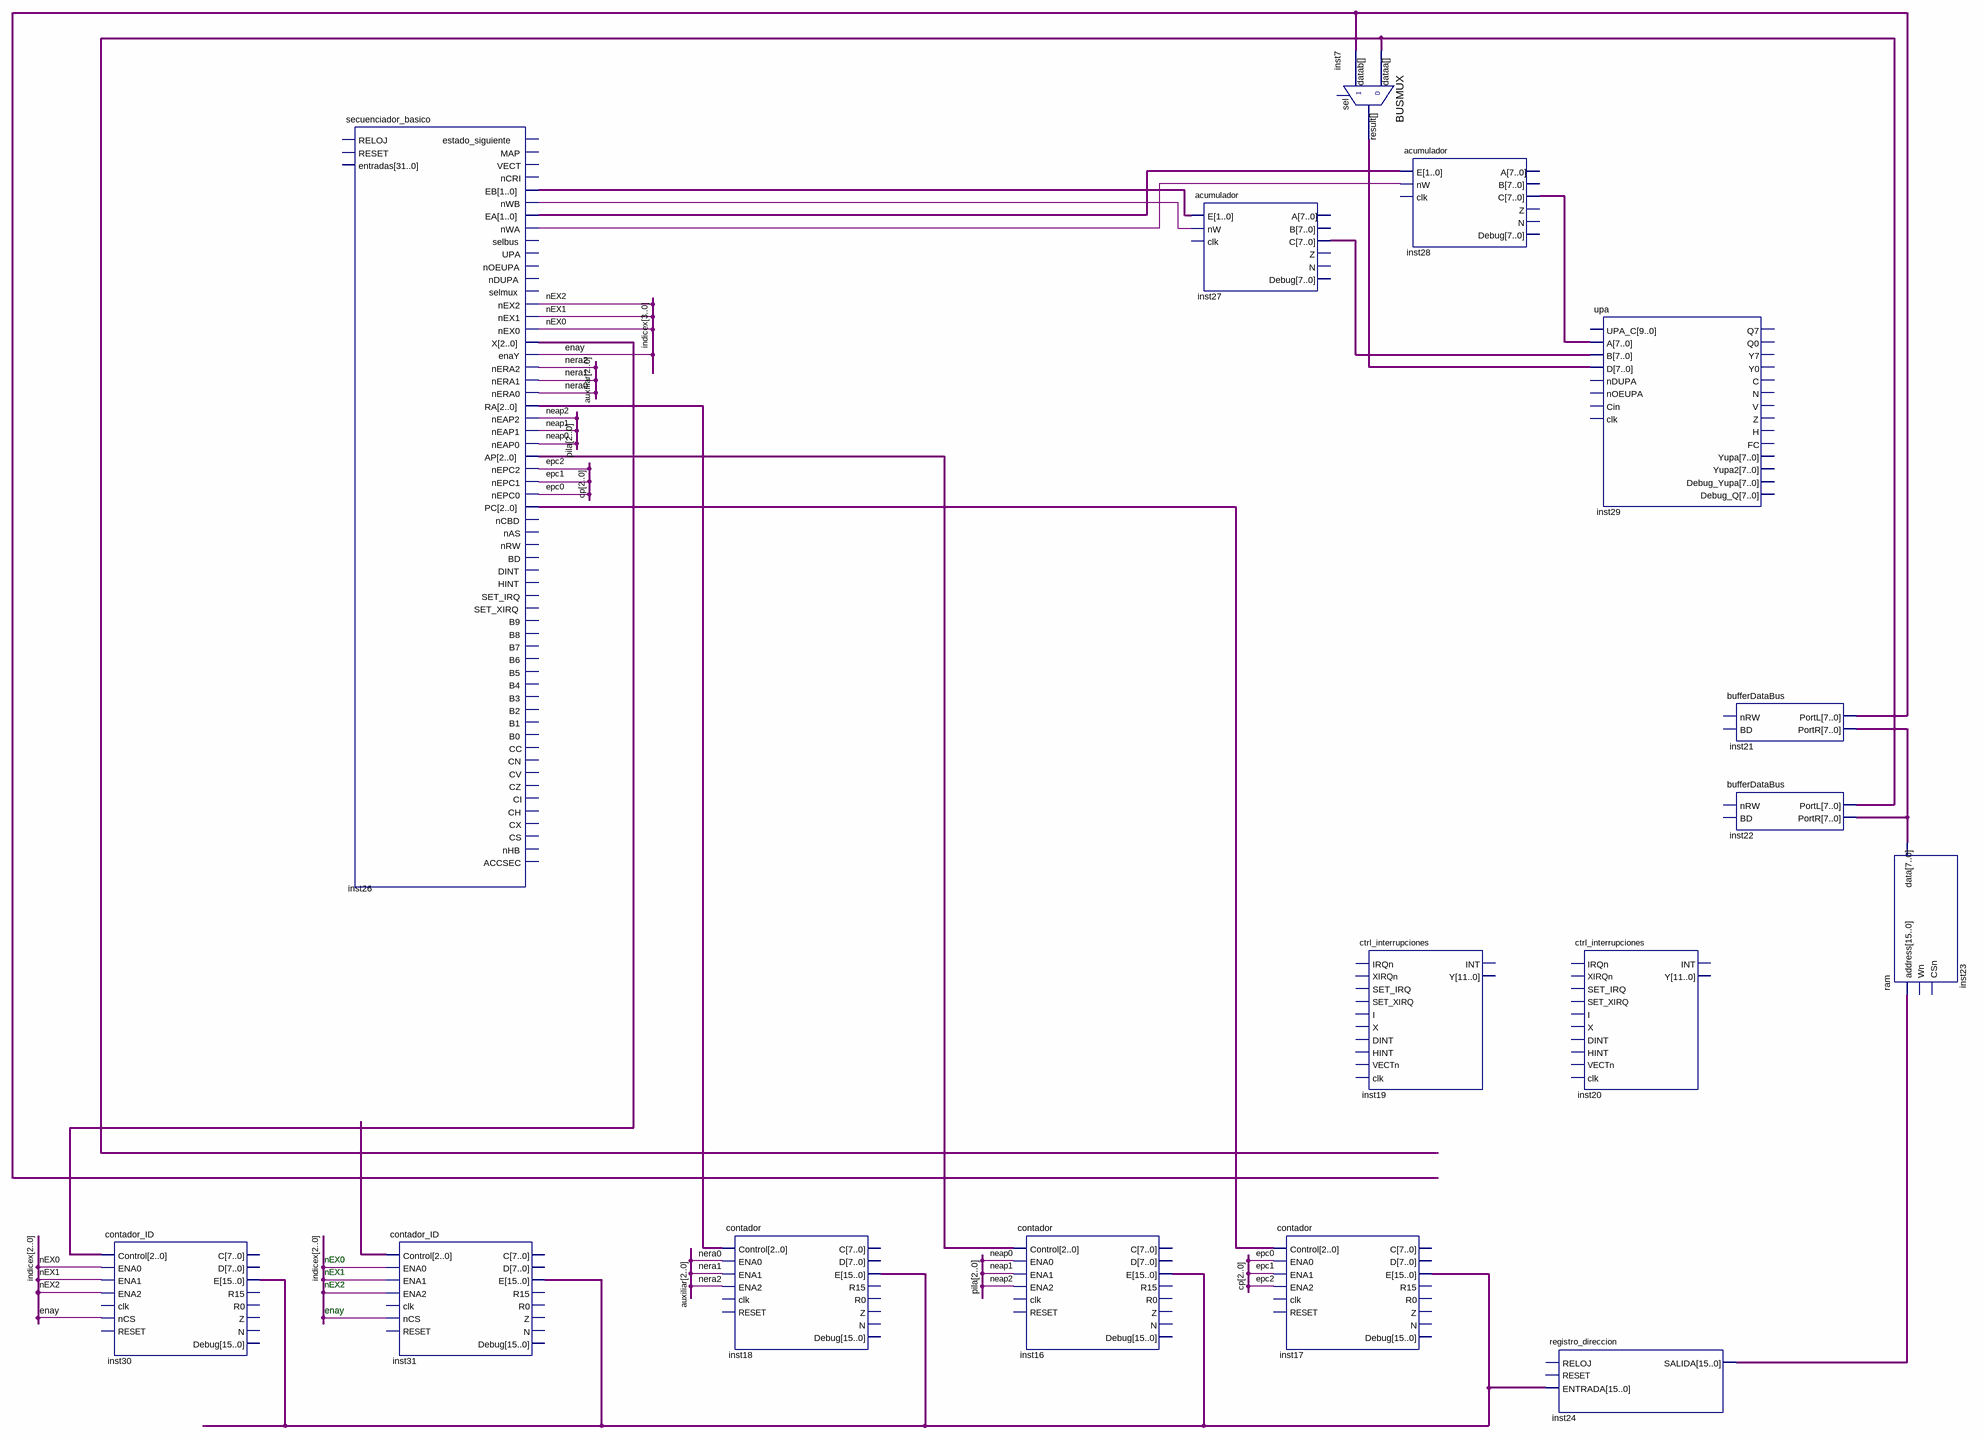
[diagram p0: schematic sheet]
// Quartus schematic OyA_P07.bdf as structural Verilog: 16 symbols, 0 pins
module OyA_P07 (
);

  wire enay, epc0, epc1, epc2, inst26_nwa, inst26_nwb, neap0, neap1, neap2, nera0, nera1, nera2, nEX0, nEX1,
       nEX2;
  wire [1:0] inst26_ea, inst26_eb;
  wire [2:0] inst26_ap, inst26_pc, inst26_ra, inst26_x, undriven;
  wire [7:0] inst7_result, inst21_portl, inst21_portr, inst22_portl, inst27_c, inst28_c;
  wire [15:0] inst24_salida, inst30_e;

  contador_ID inst30 (
    .Control(inst26_x), .ENA0(nEX0), .ENA1(nEX1), .ENA2(nEX2), .nCS(enay), .E(inst30_e));  // open: clk, RESET, Z, N, Debug, C, D, R15, R0
  secuenciador_basico inst26 (
    .EB(inst26_eb), .nWB(inst26_nwb), .EA(inst26_ea), .nWA(inst26_nwa), .nEX2(nEX2), .nEX1(nEX1),
    .nEX0(nEX0), .X(inst26_x), .enaY(enay), .nERA2(nera2), .nERA1(nera1), .nERA0(nera0), .RA(inst26_ra),
    .nEAP2(neap2), .nEAP1(neap1), .nEAP0(neap0), .AP(inst26_ap), .nEPC2(epc2), .nEPC1(epc1), .nEPC0(epc0),
    .PC(inst26_pc));  // open: RELOJ, RESET, entradas, estado_siguiente, MAP, VECT, nCRI, selbus, UPA, nOEUPA, nDUPA, selmux, nCBD, nAS, nRW, BD, DINT, HINT, SET_IRQ, SET_XIRQ, B9, B8, B7, B6, B5, B4, B3, B2, B1, B0, CC, CN, CV, CZ, CI, CH, CX, CS, nHB, ACCSEC
  contador_ID inst31 (
    .Control(undriven), .ENA0(nEX0), .ENA1(nEX1), .ENA2(nEX2), .nCS(enay), .E(inst30_e));  // open: clk, RESET, Z, N, Debug, C, D, R15, R0
  contador inst18 (
    .Control(inst26_ra), .ENA0(nera0), .ENA1(nera1), .ENA2(nera2), .E(inst30_e));  // open: clk, RESET, Z, N, Debug, C, D, R15, R0
  contador inst16 (
    .Control(inst26_ap), .ENA0(neap0), .ENA1(neap1), .ENA2(neap2), .E(inst30_e));  // open: clk, RESET, Z, N, Debug, C, D, R15, R0
  acumulador inst27 (.E(inst26_eb), .nW(inst26_nwb), .C(inst27_c));  // open: clk, Z, N, Debug, A, B
  contador inst17 (
    .Control(inst26_pc), .ENA0(epc0), .ENA1(epc1), .ENA2(epc2), .E(inst30_e));  // open: clk, RESET, Z, N, Debug, C, D, R15, R0
  BUSMUX inst7 (.datab(inst21_portl), .dataa(inst22_portl), .result(inst7_result));  // open: sel
  ctrl_interrupciones inst19 ();  // open: IRQn, XIRQn, SET_IRQ, SET_XIRQ, I, X, DINT, HINT, VECTn, clk, INT, Y
  acumulador inst28 (.E(inst26_ea), .nW(inst26_nwa), .C(inst28_c));  // open: clk, Z, N, Debug, A, B
  registro_direccion inst24 (.ENTRADA(inst30_e), .SALIDA(inst24_salida));  // open: RELOJ, RESET
  upa inst29 (
    .A(inst28_c), .B(inst27_c), .D(inst7_result));  // open: UPA_C, nDUPA, nOEUPA, Cin, clk, Q7, Q0, Y7, Y0, C, N, V, Z, H, FC, Yupa, Yupa2, Debug_Yupa, Debug_Q
  ctrl_interrupciones inst20 ();  // open: IRQn, XIRQn, SET_IRQ, SET_XIRQ, I, X, DINT, HINT, VECTn, clk, INT, Y
  bufferDataBus inst21 (.PortL(inst21_portl), .PortR(inst21_portr));  // open: nRW, BD
  bufferDataBus inst22 (.PortL(inst22_portl), .PortR(inst21_portr));  // open: nRW, BD
  ram inst23 (.address(inst24_salida), .data(inst21_portr));  // open: Wn, CSn

  // Notes on the sheet:
  //   nEX0
  //   nEX1
  //   nEX2
  //   enay
endmodule
